# Altium schematic sheet XBeeRadioMain.SchDoc
size A4; SheetNumber: 1; SheetTotal: 4
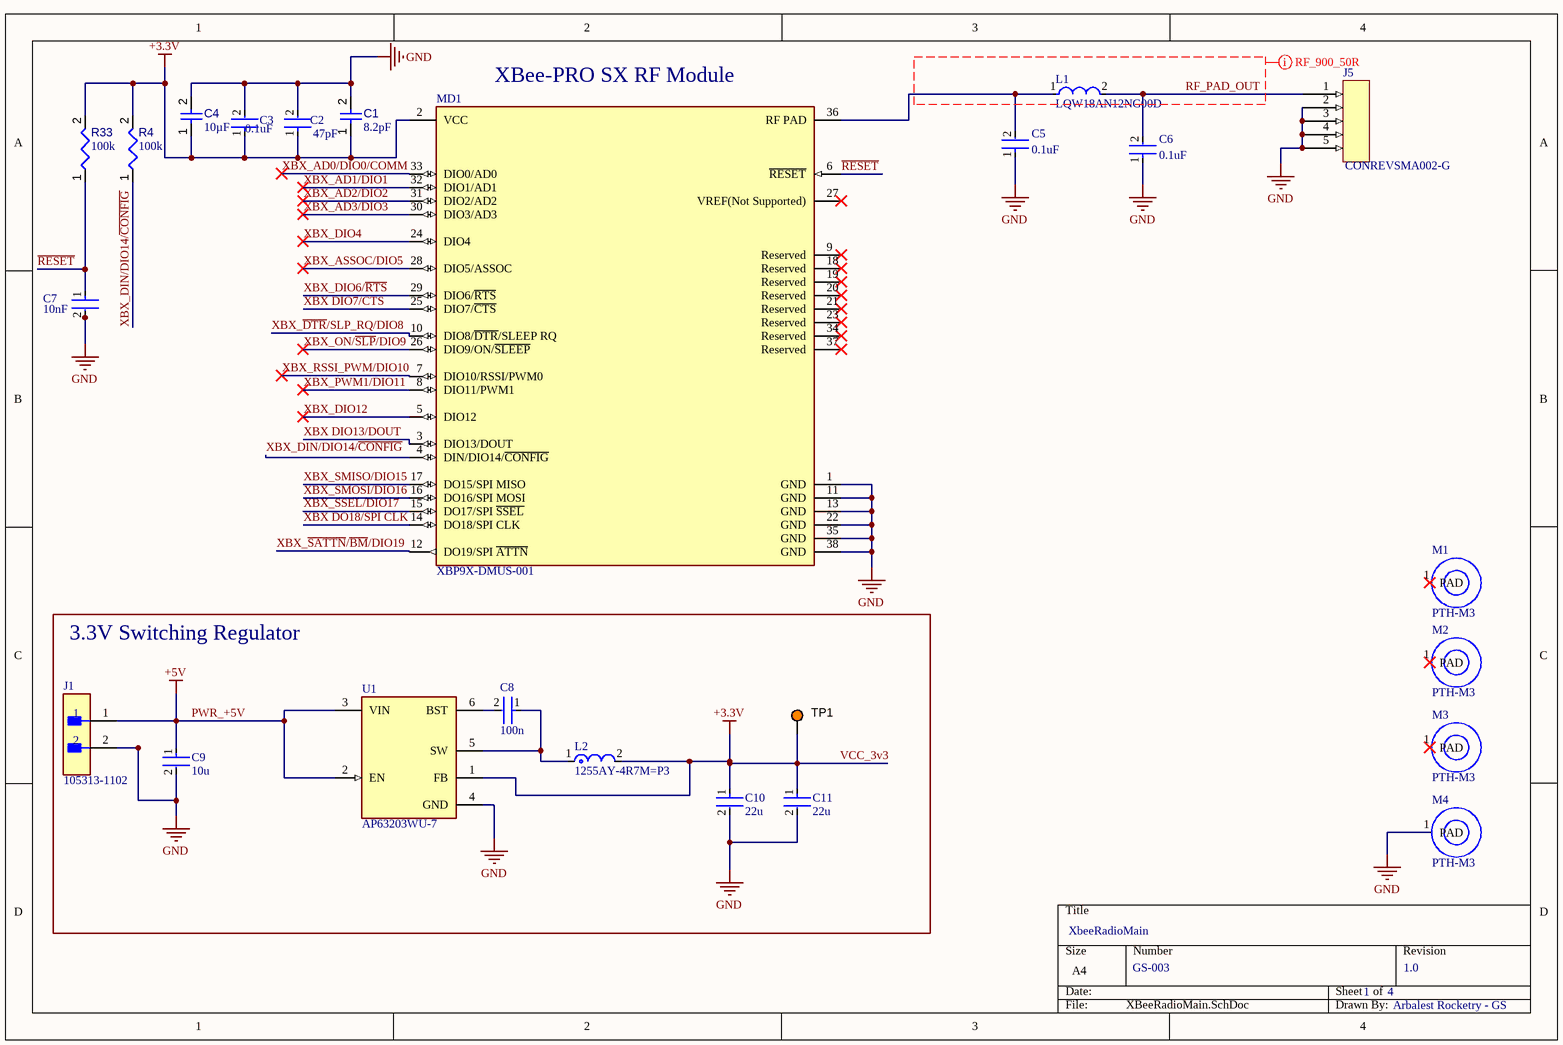
[diagram p0: XBeeRadioMain.SchDoc]

## Parts
C1  value 8.2pF  [CAPC1608X06N]  (hidden comment: 600S8R2BT250XT4K)
C2  47pF  [FP-C0805C470JDGACTU-MFG]
C3  0.1uF  [FP-C0603C-CF-MFG]
C4  value 10µF  [CAPC0805(2012)145_L]  (hidden comment: Capacitor 10µF +/-20% 25V 0805)
C5  0.1uF  [FP-C0603C-CF-MFG]
C6  0.1uF  [FP-C0603C-CF-MFG]
C7  10nF  [FP-C0603C-CF-MFG]
C8  100n  [FP-0603-L_1_6_0_1-W_0_8_0-MFG]
C9  10u  [FP-GRM21B-0_2-e0_2_0_7-IPC_B]
C10  22u  [FP-1210-L_3_2_0_3-W_2_5_0-IPC_A]
C11  22u  [FP-1210-L_3_2_0_3-W_2_5_0-IPC_A]
J1  105313-1102  [FP-105313-1102-MFG]
J5  CONREVSMA002-G  [CONREVSMA002-G-Footprint-1]
L1  LQW18AN12NG00D  [FP-LQW18AN_00-MFG]
L2  1255AY-4R7M=P3  [FP-DG6045C-MFG]
M1  PTH-M3  [PTH-M3-Footprint-1]
M2  PTH-M3  [PTH-M3-Footprint-1]
M3  PTH-M3  [PTH-M3-Footprint-1]
M4  PTH-M3  [PTH-M3-Footprint-1]
MD1  XBP9X-DMUS-001  [FP-XBP9X-DMUS-001-MFG]
R4  value 100k  [RESC2013X70X40ML20T20]  (hidden comment: Resistor 100k +/-1% 0805 125 mW)
R33  value 100k  [RESC2013X70X40ML20T20]  (hidden comment: Resistor 100k +/-1% 0805 125 mW)
TP1  3V3  [KSTN-5003]  (value not drawn)
U1  AP63203WU-7  [FP-TSOT26-MFG]

## Blocks framed on the sheet
3.3V Switching Regulator: C8-C11 J1 L2 TP1 U1

## Nets
GND: C1.2 C2.2 C3.2 C4.2 C5.1 C6.1 C7.2 C9.2 C10.2 C11.2 J1.2 J5.2 J5.3 J5.4 J5.5 M4.1(PAD) MD1.1(GND) MD1.11(GND) MD1.13(GND) MD1.22(GND) MD1.35(GND) MD1.38(GND) U1.4(GND)
PWR_+5V: C9.1 J1.1 U1.2(EN) U1.3(VIN)  [also labelled +5V]
VCC_3v3: C1.1 C2.1 C3.1 C4.1 C10.1 C11.1 L2.2 MD1.2(VCC) R4.2 R33.2 TP1.1 U1.1(FB)  [also labelled +3.3V]
~{RESET}: C7.1 MD1.6(~{RESET}) R33.1
RF_PAD_OUT: C6.2 J5.1 L1.2
XBX DIO7/~{CTS}: MD1.25(DIO7/~{CTS})
XBX DIO13/DOUT: MD1.3(DIO13/DOUT)
XBX DO18/SPI CLK: MD1.14(DO18/SPI_CLK)
XBX_AD0/DIO0/COMM: MD1.33(DIO0/AD0)
XBX_AD1/DIO1: MD1.32(DIO1/AD1)
XBX_AD2/DIO2: MD1.31(DIO2/AD2)
XBX_AD3/DIO3: MD1.30(DIO3/AD3)
XBX_ASSOC/DIO5: MD1.28(DIO5/ASSOC)
XBX_~{DTR}/SLP_RQ/DIO8: MD1.10(DIO8/~{DTR}/SLEEP_RQ)
XBX_DIN/DIO14/~{CONFIG}: MD1.4(DIN/DIO14/~{CONFIG}) R4.1
XBX_DIO4: MD1.24(DIO4)
XBX_DIO6/~{RTS}: MD1.29(DIO6/~{RTS})
XBX_DIO12: MD1.5(DIO12)
XBX_ON/~{SLP}/DIO9: MD1.26(DIO9/ON/~{SLEEP})
XBX_PWM1/DIO11: MD1.8(DIO11/PWM1)
XBX_RSSI_PWM/DIO10: MD1.7(DIO10/RSSI/PWM0)
XBX_~{SATTN}/~{BM}/DIO19: MD1.12(DO19/SPI_~{ATTN})
XBX_~{SSEL}/DIO17: MD1.15(DO17/SPI_~{SSEL})
XBX_SMISO/DIO15: MD1.17(DO15/SPI_MISO)
XBX_SMOSI/DIO16: MD1.16(DO16/SPI_MOSI)
NetC5_2: C5.2 L1.1 MD1.36(RF_PAD)
NetC8_1: C8.1 L2.1 U1.5(SW)
NetC8_2: C8.2 U1.6(BST)

Not connected (* = marked no-connect by the designer): M1 1(PAD)*; M2 1(PAD)*; M3 1(PAD)*; MD1 9(Reserved)* 18(Reserved)* 19(Reserved)* 20(Reserved)* 21(Reserved)* 23(Reserved)* 27(VREF(Not_Supported))* 34(Reserved)* 37(Reserved)*

## Layout directives
net class RF_900_50R: RF_PAD_OUT

## Notes on the sheet
- (near MD1) XBee-PRO SX RF Module
- XbeeRadioMain
- GS-003
- 1
- 4
- 1.0
- Arbalest Rocketry - GS

## Library data of the parts
C1 = CMP-001-00086-1: Ceramic Capacitor, Multilayer, Ceramic, 250V, 1.22% +Tol, 1.22% -Tol, C0G, 30ppm/Cel TC, 0.0000082uF, Surface Mount,...; Max Operating Temperature: 125°C; Mounting Technology: Surface Mount; Min Operating Temperature: -55°C
C2 = CMP-2007-03325-2: CAP CER 47PF 1KV C0G/NP0 0805; Tolerance: 5%; Dissipation Factor: 0.1%; Dielectric: C0G; Voltage Rating (DC): 1.5kV; Dielectric Material: Ceramic; Lead Free: Lead Free; Case/Package: 0805; Construction: Flat; Thickness: 0.055inch; RoHS Compliant: Yes; Length: 0.079inch; Min Operating Temperature: -55°C; Max Operating Temperature: 125°C; Width: 0.049inch; Voltage Rating: 1kV; Radiation Hardening: No; Packaging: Tape and Reel; Termination: SMD/SMT; Series: C; Case Code (Metric): 2012; Mount: Surface Mount; Height: 1.25mm; Capacitance: 47pF; Case Code (Imperial): 0805; Package Quantity: 1; Depth: 1.2mm
C3 C5 C6 = CMP-2006-03061-2: CAP CER 0.1UF 50V X7R 0603; Manufacturer: KEMET; Manufacturer Part Number: C0603C104K5RACTU; Tolerance: 0.1; Temperature Coefficient: 30ppm/°C; Material: Ceramic; Automotive Grade: Grade 1; Value: 0.10 μF; Temperature: -55°C to +125°C; RoHS: TRUE; Temperature Range High: +125°C; Lead Free: Yes; Octopart: https://octopart.com/c0603c104k5ractu-kemet-139244; Digikey Description: CAP CER 0.1UF 50V X7R 0603; Category: Cap; Package: C0603C-CF; ComponentLink2Description: Datasheet; Temperature Range Low: -55°C; Device Class L1: Passive Components; Voltage Rating: 50 V; Automotive: Yes; Device Class L3: Ceramic Capacitors; ComponentLink2URL: https://api.kemet.com/component-edge/download/datasheet/C0603C100J5GACAUTO.pdf; Capacitance: 0.10 μF; Device Class L2: Capacitors; Temperature Characteristic: X7R; Height: 0.87mm
C4 = CMP-001-00079-4: Chip Capacitor, 10µF +/-20%, 25V, 0805, Thickness 1.45 mm; Tolerance: 10%; Max Operating Temperature: 85°C; Case/Package: 0805; Voltage Rating: 25V; Min Operating Temperature: -55°C; Mounting Technology: SMT; Pins: 2
C7 = CMP-2006-03046-3: CAP CER 10000PF 50V X7R 0603; Manufacturer: KEMET; Manufacturer Part Number: C0603C103K5RACTU; Temperature Coefficient: 30ppm/°C; Capacitance: 10,000 pF; Automotive Grade: Grade 1; Material: Ceramic; Value: 10,000 pF; Tolerance: 0.1; Voltage Rating: 50 V; Digikey Description: CAP CER 10000PF 50V X7R 0603; ComponentLink2Description: Datasheet; Mouser Description: Ceramic Capacitor 0.01Uf, 50V, X7R, 10%, 0603, Full Reel; ComponentLink2URL: https://api.kemet.com/component-edge/download/datasheet/C0603C100J5GACAUTO.pdf; Package: C0603C-CF; RoHS: TRUE; Octopart: https://octopart.com/c0603c103k5ractu-kemet-133094; Device Class L1: Passive Components; Temperature Range Low: -55°C; Automotive: Yes; Category: Cap; Lead Free: Yes; Temperature: -55°C to +125°C; Temperature Range High: +125°C; Temperature Characteristic: X7R; Height: 0.87mm; Device Class L3: Ceramic Capacitors; Device Class L2: Capacitors
C8 = CMP-14477-001538-2: None; Voltage Rating: 35V; Tolerance: 10%; Dielectric: X7R; Capacitance: 100nF; Case Code (Imperial): 0603; Case/Package: 0603; Packaging: Tape and Reel; Height: 0.8mm; Termination: SMD/SMT; Ratings: AEC-Q200; Min Operating Temperature: -55°C; Length: 0.063inch; Case Code (Metric): 1608; Lead Free: Lead Free; Halogen Free: Halogen Free; Mount: Surface Mount; Max Operating Temperature: 125°C; Width: 0.031inch; Voltage Rating (DC): 35V; Package Quantity: 1; Thickness: 0.035inch; RoHS Compliant: Yes
C9 = CMP-06035-047417-1: Chip Multilayer Ceramic Capacitors for General Purpose, 0805, 10uF, X7R, 15%, 10%, 25V
C10 C11 = CMP-14477-001688-2: None; Voltage Rating: 25V; Capacitance: 22uF; Tolerance: 20%; Mount: Surface Mount; Case Code (Metric): 3225; Min Operating Temperature: -55°C; Case Code (Imperial): 1210; Case/Package: 1210; Max Operating Temperature: 125°C; Packaging: Tape and Reel; RoHS Compliant: Yes
J1 = CMP-04776-000341-1: CONN HEADER R/A 2POS 2.5MM
J5 = CMP-002-00083-1: RF SMA Connector, Male, Board Mount, Solder Terminal; Manufacturer Lifecycle Status: ACTIVE; Impedance: 50Ω; Number of Positions: 1; China RoHS: Compliant; Packaging: Bulk; Contact Gender: Male
L1 = CMP-06042-001615-1: Wire Wound RF Inductor 12nH ±2% 600mA 0.13Ω 0603 (1608); Test Frequency: 100MHz; Series Resistance: 130mR; Self Resonant Frequency: 6GHz; Current: 500mA; Shielding: Unshielded; Q Factor: 35; Inductance: 12nH; Case Code (Metric): 1608; Case/Package: 0603; Max Operating Temperature: 125°C; Height: 0.8mm; Case Code (Imperial): 0603; Min Operating Temperature: -55°C; Radiation Hardening: No; Width: 0.8mm; Package Quantity: 4000; Number of Pins: 2; Tolerance: 2%; Lead Free: Lead Free; Termination: SMD/SMT; DC Resistance (DCR): 130mR; Packaging: Tape and Reel; Inductance Tolerance: 2%; Current Rating: 600mA; Weight: 0.000106oz; Length: 1.6mm; REACH SVHC: No SVHC; DC Current: 600mA; Depth: 1mm; Military Standard: Not; Max DC Current: 600mA; Resistor Type: Wirewound; Mount: Surface Mount
L2 = CMP-06042-012577-1: Shielded Wirewound Inductor 4.7uH 20% 4000mA 0.0276Ω SMD; Core Material: Ferrite; DC Resistance (DCR): 27.6mR; Test Frequency: 100kHz; Max DC Current: 4A; Current Rating: 4.5A; Packaging: Tape and Reel; Resistor Type: Wirewound; Tolerance: 20%; Height - Seated (Max): 0.177inch; Inductance: 4.7uH; Case/Package: Nonstandard; Shielding: Shielded; Length: 0.248inch; Width: 0.248inch; Mount: Surface Mount
M1-M4 = CMP-00028-00007-1: Mounting hole for M3 screw; Pins: 1; Case/Package: M3; Mounting Technology: THT
MD1 = CMP-84319-000001-1: XBEE PRO MOD TXRX ISM 915MHZ UFL; Manufacturer: Digi International; Min Supply Voltage: 2.4V; Max Supply Voltage: 3.6V; Number Of Adc Channels: 4; Interface: SPI,UART; Receiving Current: 40mA; Bandwidth: 26MHz; Max Frequency: 928MHz; Transmitting Current: 330-900mA; Data Rate: 250kbits/s; Sensitivity: -103dBm; Number Of Gpio: 20; Automotive: No; Lead Free: Yes; Package: 0; Height: 3.556mm; Temperature Range Low: -40°C; Temperature Range High: +85°C; Temperature: -40°C to +85°C; Device Class L1: Integrated Circuits (ICs); Category: UNK; Device Class L3: Transceivers; ComponentLink2URL: https://www.digi.com/resources/documentation/digidocs/pdfs/90001477.pdf; Digikey Description: XBEE PRO MOD TXRX ISM 915MHZ UFL; Octopart: https://octopart.com/xbp9x-dmus-001-digi+international-71530758; Device Class L2: RF Semiconductors and Devices; ComponentLink2Description: Datasheet; RoHS: TRUE; Manufacturer Part Number: XBP9X-DMUS-001
R4 R33 = CMP-009-00024-5: Chip Resistor, 100 KOhm, +/- 1%, 0.125 W, -55 to 155 degC, 0805 (2012 Metric); Power: 125mW; Voltage Rating: 150V; Max Operating Temperature: 155°C; Mounting Technology: SM; RoHS Compliant: True; Tolerance: 1%; Case/Package: 0805; Min Operating Temperature: -55°C; Pins: 2
TP1 = CMP-002-00037-2: Test Point, Orange, Height 4.6 mm, Tail Length 3 mm, 1-Pin THD, RoHS; Manufacturer: Keystone; Colour: Orange; Packaging: Bulk; Package Description: 1-Pin Through Hole Device, Dia 2.54 mm; Pins: 1; Package Reference: 5003; Datasheet Version: Jun-15; Case/Package: 5003; Mounting Technology: TH; Connector Type: TestPoint; Diameter: 2.54mm; Contact Material: Bronze; Datasheet URL: http://keyelco.com/userAssets/file/M65p56.pdf; Manufacturer URL: http://www.keyelco.com/; Package Quantity: 10; Contact Plating: Tin; RoHS Compliant: True
U1 = CMP-12757-000006-1: IC REG BUCK 3.3V 2A TSOT26; Manufacturer: Diodes Inc.; Output Type: Fixed; Min Supply Voltage: 3.8V; Number Of Outputs: 1; Max Junction Temp: +160°C; Nominal Supply Current: 22uA; Standoff Height: 0.01mm; Switching Frequency: 1.1MHz; Max Supply Voltage: 32V; ComponentLink2Description: Datasheet; Device Class L1: Integrated Circuits (ICs); Temperature: to +160°C; Device Class L3: Voltage Regulators - Switching; RoHS: TRUE; Octopart: https://octopart.com/ap63203wu-7-diodes+inc.-98099550; Output Voltage: 3.3V; Lead Free: Yes; ComponentLink2URL: https://www.diodes.com/assets/Datasheets/AP63200-AP63201-AP63203-AP63205.pdf; Digikey Description: IC REG BUCK 3.3V 2A TSOT26; Footprint Url: https://www.diodes.com/assets/Package-Files/TSOT26.pdf; Ambient Temperature Range High: +85°C; Height: 1mm; Automotive: No; Temperature Range High: +160°C; Switching Topology: Buck; Output Current: 2A; Package: TSOT26; Category: IC; Mouser Description: AP63203 Series 3.3 V 2 A SMT Fixed Low IQ Synchronous Buck - TSOT-26; Device Class L2: Power Management ICs; Ambient Temperature Range Low: -40°C; Manufacturer Part Number: AP63203WU-7